# Altium schematic sheet PIC.SchDoc
size A4
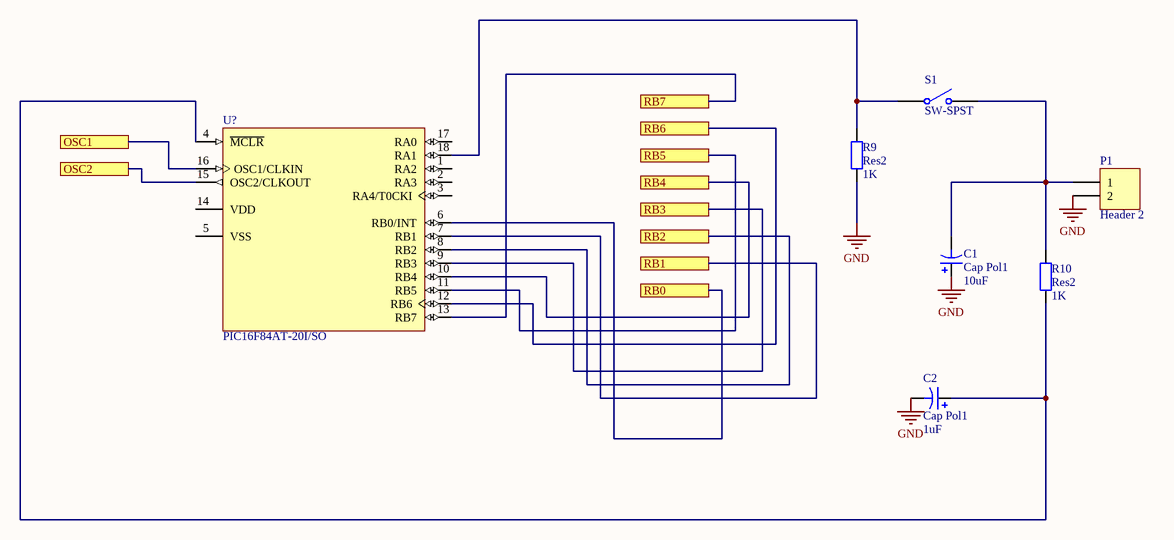
[diagram p0: PIC.SchDoc]

## Parts
C1  Cap Pol1  value 10uF  [RB7.6-15]
C2  Cap Pol1  value 1uF  [RB7.6-15]
P1  Header 2  [HDR1X2]
R9  Res2  value 1K  [AXIAL-0.4]
R10  Res2  value 1K  [AXIAL-0.4]
S1  SW-SPST  [SPST-2]
U?  PIC16F84AT-20I/SO  [SOIC-SO18_N]

## Ports
OSC1, OSC2, RB0, RB1, RB2, RB3, RB4, RB5, RB6, RB7

## Nets
GND: C1.1 C2.2 P1.2 R9.1
OSC1: U?.16(OSC1/CLKIN) ; port OSC1
OSC2: U?.15(OSC2/CLKOUT) ; port OSC2
RB0: U?.6(RB0/INT) ; port RB0
RB1: U?.7(RB1) ; port RB1
RB2: U?.8(RB2) ; port RB2
RB3: U?.9(RB3) ; port RB3
RB4: U?.10(RB4) ; port RB4
RB5: U?.11(RB5) ; port RB5
RB6: U?.12(RB6) ; port RB6
RB7: U?.13(RB7) ; port RB7
NetC1_2: C1.2 P1.1 R10.2 S1.2(NO)
NetC2_1: C2.1 R10.1 U?.4(~{MCLR})
NetR9_2: R9.2 S1.1(COMMON) U?.18(RA1)

Not connected (* = marked no-connect by the designer): U? 1(RA2) 2(RA3) 3(RA4/T0CKI) 5(VSS) 14(VDD) 17(RA0)

## Library data of the parts
C1 C2 = Cap Pol1: Polarized Capacitor (Radial); Published: 8-Jun-2000; LatestRevisionDate: 17-Jul-2002; LatestRevisionNote: Re-released for DXP Platform.; PackageReference: RB7.6-15; Publisher: Altium Limited; PackageDescription: Polarized Capacitor (Radial); 2 Leads
P1 = Header 2: Header, 2-Pin; LatestRevisionDate: 17-Jul-2002; LatestRevisionNote: Re-released for DXP Platform.; Publisher: Altium Limited
R9 R10 = Res2: Resistor; Published: 8-Jun-2000; LatestRevisionDate: 17-Jul-2002; LatestRevisionNote: Re-released for DXP Platform.; PackageReference: AXIAL-0.4; Publisher: Altium Limited; PackageDescription: Axial Device, Thru-Hole; 2 Leads; 0.4 in Pin Spacing
S1 = SW-SPST: Single-Pole, Single-Throw Switch; Published: 24-Mar-1999; LatestRevisionDate: 17-Jul-2002; LatestRevisionNote: Re-released for DXP Platform.; PackageReference: SPST-2; Publisher: Altium Limited; PackageDescription: Switch; 2 Leads
U? = PIC16F84AT-20I/SO: Enhanced FLASH/EEPROM 8-Bit Microcontroller, 1K (x14-Bit words) FLASH, 68 Bytes RAM, 20 MHz, 18-Pin SOIC, Standard VDD Range, Industrial Temperature, Tape and Reel; Published: 11-Oct-2004; LatestRevisionDate: 29-Jan-2009; LatestRevisionNote: Sch. layout revised. 3D Model Removed.; DatasheetVersion: revB, Aug-2001; PackageVersion: revBB, Aug-2009; PackageReference: SOIC-SO18; Publisher: Altium Limited; PackageDescription: 18-Lead Plastic Small Outline (SO) - Wide 7.50mm Body [SOIC]; Supplier 1: Digi-Key; Supplier Part Number 1: PIC16F84AT-20I/SO-ND; Code_JEDEC: MS-013; ComponentLink1Description: Datasheet; ComponentLink1URL: http://ww1.microchip.com/downloads/en/DeviceDoc/35007b.pdf; ComponentLink2Description: Packaging Specification; ComponentLink2URL: http://www.microchip.com/stellent/groups/techpub_sg/documents/packagingspec/en012702.pdf; ComponentLink3Description: Microchip.com Home; ComponentLink3URL: http://www.microchip.com/